# Altium schematic sheet TOP_HEADER_WRP.SchDoc
size A; DocumentNumber: 11; SheetNumber: 11; SheetTotal: 13
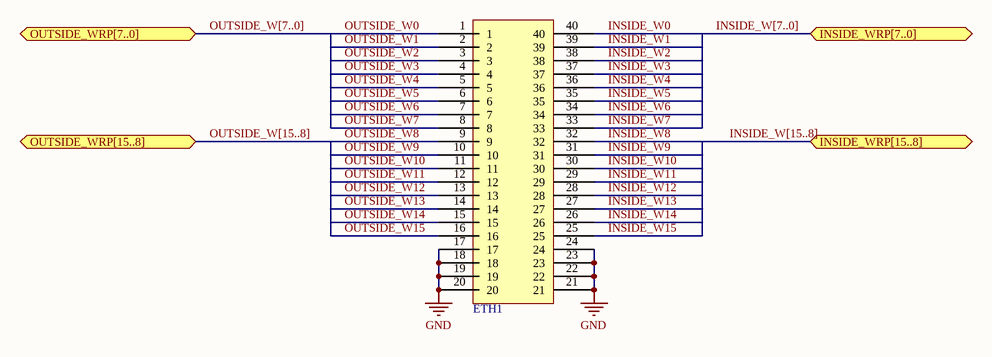
[diagram p0: TOP_HEADER_WRP.SchDoc]

## Parts
ETH1  ADAFRUIT_HEADER  [FEMALE_HEADER_SMD]  (value not drawn)

## Ports
INSIDE_WRP[7..0], INSIDE_WRP[15..8], OUTSIDE_WRP[7..0], OUTSIDE_WRP[15..8]

## Nets
GND: ETH1.17 ETH1.18 ETH1.19 ETH1.20 ETH1.21 ETH1.22 ETH1.23 ETH1.24
INSIDE_W0: ETH1.40
INSIDE_W1: ETH1.39
INSIDE_W2: ETH1.38
INSIDE_W3: ETH1.37
INSIDE_W4: ETH1.36
INSIDE_W5: ETH1.35
INSIDE_W6: ETH1.34
INSIDE_W7: ETH1.33
INSIDE_W8: ETH1.32
INSIDE_W9: ETH1.31
INSIDE_W10: ETH1.30
INSIDE_W11: ETH1.29
INSIDE_W12: ETH1.28
INSIDE_W13: ETH1.27
INSIDE_W14: ETH1.26
INSIDE_W15: ETH1.25
OUTSIDE_W0: ETH1.1
OUTSIDE_W1: ETH1.2
OUTSIDE_W2: ETH1.3
OUTSIDE_W3: ETH1.4
OUTSIDE_W4: ETH1.5
OUTSIDE_W5: ETH1.6
OUTSIDE_W6: ETH1.7
OUTSIDE_W7: ETH1.8
OUTSIDE_W8: ETH1.9
OUTSIDE_W9: ETH1.10
OUTSIDE_W10: ETH1.11
OUTSIDE_W11: ETH1.12
OUTSIDE_W12: ETH1.13
OUTSIDE_W13: ETH1.14
OUTSIDE_W14: ETH1.15
OUTSIDE_W15: ETH1.16

## Buses and harness runs
bus INSIDE_W[7..0] = port INSIDE_WRP[7..0]
bus INSIDE_W[15..8] = port INSIDE_WRP[15..8]
bus OUTSIDE_W[7..0] = port OUTSIDE_WRP[7..0]
bus OUTSIDE_W[15..8] = port OUTSIDE_WRP[15..8]

## Library data of the parts
ETH1 = ADAFRUIT_HEADER: Extra tall female header (SMD)